# EAGLE schematic Pumpkin (EAGLE 7.5.0)
DESIGNER: Adam Green
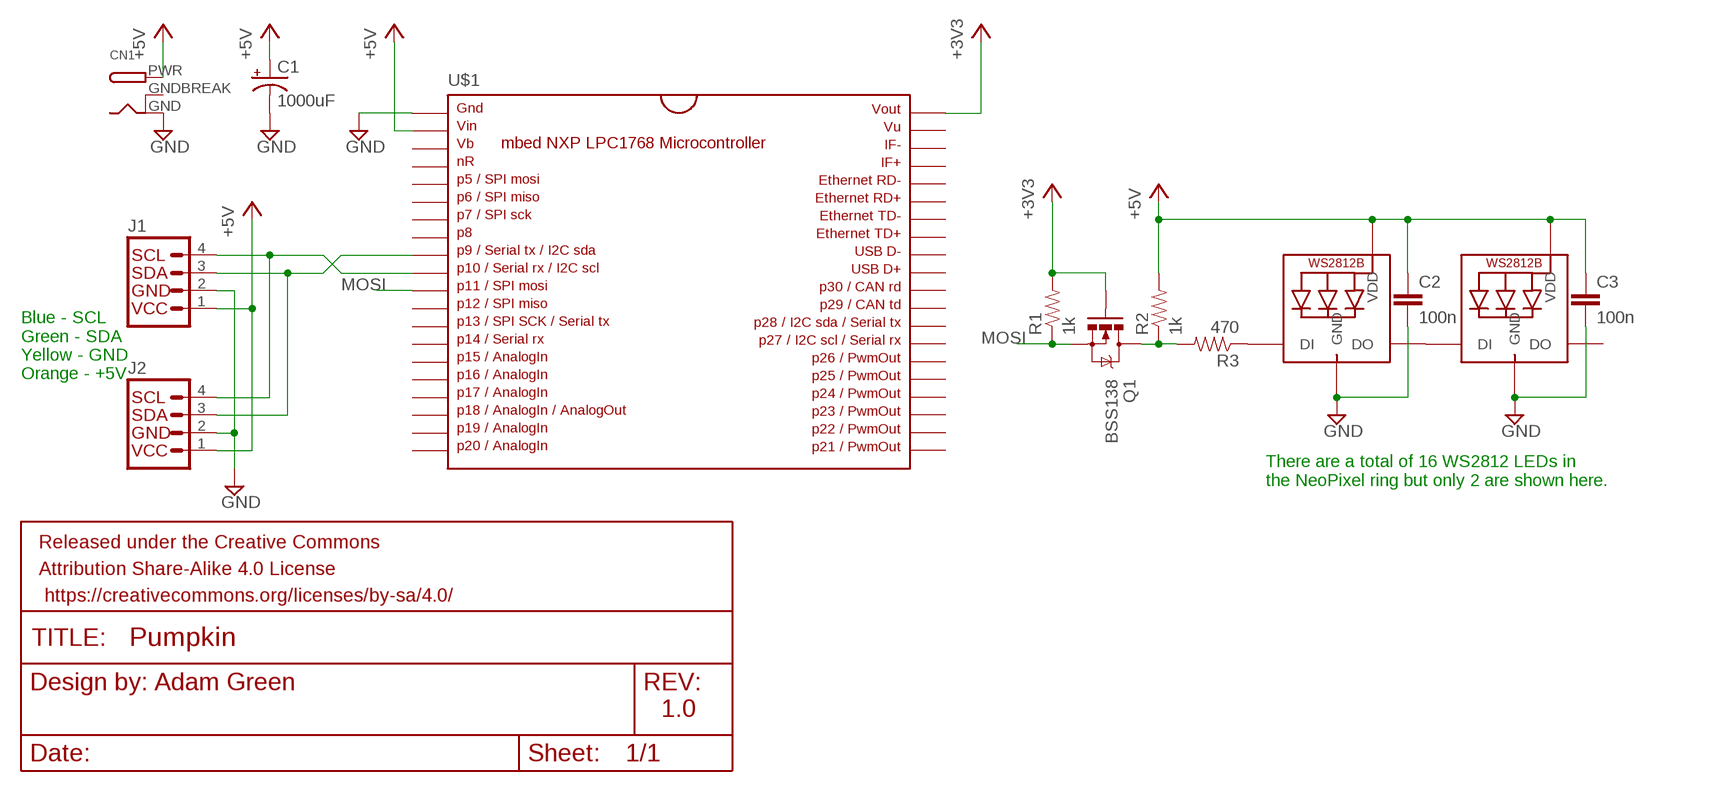
[diagram p0: schematic, sheet 1]

## Parts
C1  1000uF  CAP_POLPTH4  [CPOL-RADIAL-1000UF-25V]
C2  100n  CAP0805  [0805]
C3  100n  CAP0805  [0805]
CN1  DCBARRELPTH  [DCJACK_2MM_PTH]
J1  I2C_LEDEYES  [1X04]
J2  I2C_LEDEYES  [1X04]
LED1  WS2812B3535  [LED3535]
LED2  WS2812B3535  [LED3535]
Q1  BSS138  MOSFET-NCHANNELBSS138  [SOT23-3]
R1  1k  RESISTOR0805-RES  [0805]
R2  1k  RESISTOR0805-RES  [0805]
R3  470  RESISTOR0805-RES  [0805]
U$1  MBED_NXP_LPC1768  [DIL40_0.9]

## Nets
+3V3: Q1.1(G) R1.2 U$1.40
+5V: C1.1(+) C2.1 C3.1 CN1.PWR J1.1 J2.1 LED1.2(VDD) LED2.2(VDD) R2.2 U$1.2
GND: C1.2(-) C2.2 C3.2 CN1.GND J1.2 J2.2 LED1.4(GND) LED2.4(GND) U$1.1
MOSI: Q1.2(S) R1.1 U$1.11
N$1: LED1.3(DO) LED2.1(DI)
N$2: Q1.3(D) R2.1 R3.2
N$4: LED1.1(DI) R3.1
N$6: J1.3 J2.3 U$1.9
N$7: J1.4 J2.4 U$1.10
Unconnected: LED2.3(DO) U$1.3 U$1.4 U$1.5 U$1.6 U$1.7 U$1.8 U$1.12 U$1.13 U$1.14 U$1.15 U$1.16 U$1.17 U$1.18 U$1.19 U$1.20 U$1.21 U$1.22 U$1.23 U$1.24 U$1.25 U$1.26 U$1.27 U$1.28 U$1.29 U$1.30 U$1.31 U$1.32 U$1.33 U$1.34 U$1.35 U$1.36 U$1.37 U$1.38 U$1.39

## Notes on the sheet
- Blue - SCL
  Green - SDA
  Yellow - GND
  Orange - +5V
- There are a total of 16 WS2812 LEDs in
  the NeoPixel ring but only 2 are shown here.
- 1.0

## Power pins joined to a net without a drawn wire
GNDBREAK: CN1.GNDBREAK

## Library data of the parts
C1 = SparkFun-Passives:CAP_POL: Capacitor Polarized These are standard SMD and PTH capacitors. Normally 10uF, 47uF, and 100uF in electrolytic and tantalum varieties. Always verify the external diameter of the through hole cap, it varies with capacity, voltage, and manufacturer. The EIA devices should be standard.
C2 C3 = SparkFun-Passives:CAP: Capacitor Standard 0603 ceramic capacitor, and 0.1" leaded capacitor.
CN1 = adafruit:DCBARREL: 2.0mm DC Barrel Jack DCJACK_2MM_PTH - Through Hole Jack (4UConnector: 05537)
J1 J2 = adam_custom:I2C_LEDEYES: Pinout used by Adafruit on their Holek HT16K33 based 8x8 LED matrix boards.
LED1 LED2 = adafruit:WS2812B
Q1 = SparkFun-DiscreteSemi:MOSFET-NCHANNEL: Common NMOSFET Parts MFG P/N Store ID Prod ID FDD8780 TRANS-09984 SI7820DN TRANS-11055 FDS6630A IC-08089 2N7002PW TRANS-11151 FQP30N06L COM-10213 TRANS-10060 BSS123LT1G TRANS-08345 BSS138 TRANS-00830 BS170 2N7000; PROD_ID: TRANS-00830; VALUE: 200mA/50V
R1-R3 = SparkFun-Resistors:RESISTOR: Resistor Basic schematic elements and footprints for 0603, 1206, and PTH resistors.
U$1 = SparkFun-DigitalIC:MBED_NXP_LPC1768